# EasyEDA Pro project 25工创PCB.eprj, schematic 显示板原理图
Board Name: 显示板v1; Create Date: 2025-01-09; Page Name: P1; Project Name: 25工创PCB; Schematic Name: 显示板原理图; Update Date: 2025-03-20; Company: 嘉立创EDA; Page Size: A4; Version: V1.0
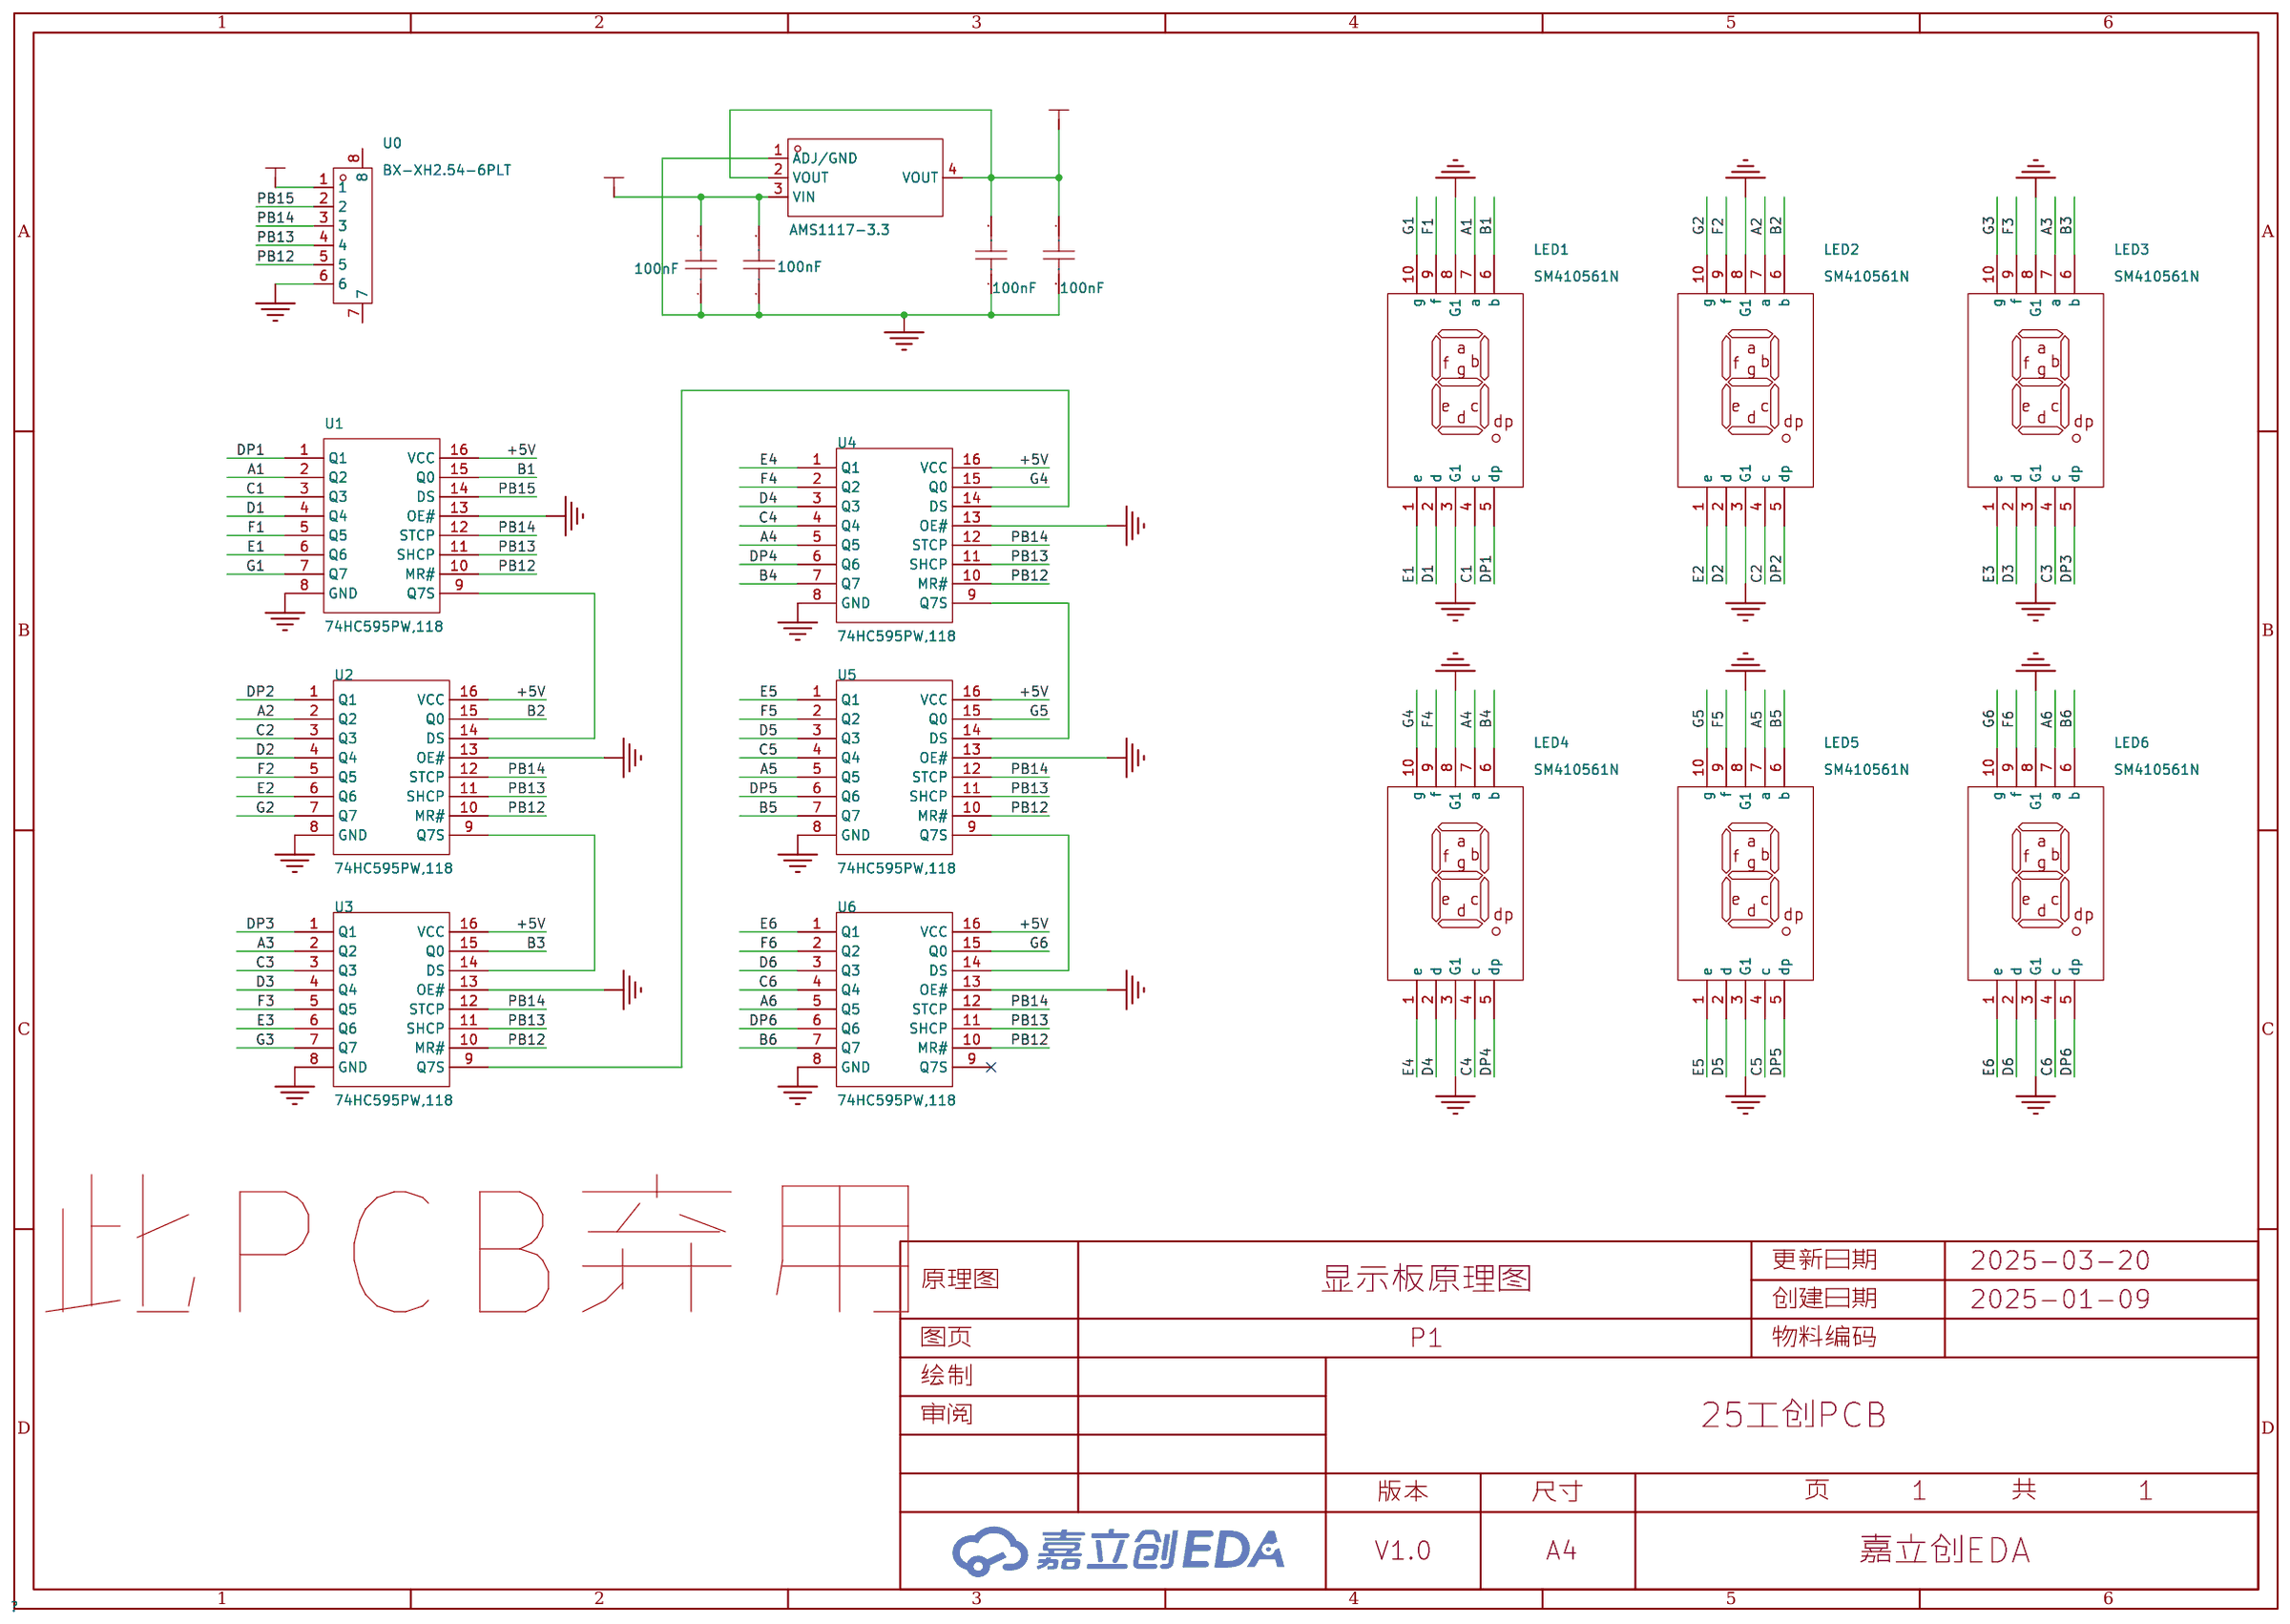
[diagram p3: schematic sheet]

## Parts
C1  100nF  [C0603]
C2  100nF  [C0603]
C3  100nF  [C0603]
C4  100nF  [C0603]
LED1  SM410561N  [LED-SEG-TH_10P-L12.7-W19.0-P2.54-S15.24-BL]
LED2  SM410561N  [LED-SEG-TH_10P-L12.7-W19.0-P2.54-S15.24-BL]
LED3  SM410561N  [LED-SEG-TH_10P-L12.7-W19.0-P2.54-S15.24-BL]
LED4  SM410561N  [LED-SEG-TH_10P-L12.7-W19.0-P2.54-S15.24-BL]
LED5  SM410561N  [LED-SEG-TH_10P-L12.7-W19.0-P2.54-S15.24-BL]
LED6  SM410561N  [LED-SEG-TH_10P-L12.7-W19.0-P2.54-S15.24-BL]
U0  BX-XH2.54-6PLT  [CONN-SMD_6P-P2.50_HANBO_WAFER-254L-6A]
U1  74HC595PW,118  [TSSOP-16_L5.0-W4.4-P0.65-LS6.4-BL]
U2  74HC595PW,118  [TSSOP-16_L5.0-W4.4-P0.65-LS6.4-BL]
U3  74HC595PW,118  [TSSOP-16_L5.0-W4.4-P0.65-LS6.4-BL]
U4  74HC595PW,118  [TSSOP-16_L5.0-W4.4-P0.65-LS6.4-BL]
U5  74HC595PW,118  [TSSOP-16_L5.0-W4.4-P0.65-LS6.4-BL]
U6  74HC595PW,118  [TSSOP-16_L5.0-W4.4-P0.65-LS6.4-BL]
U7  AMS1117-3.3  [SOT-223_L6.5-W3.5-P2.30-LS7.0-BR]

## Library data of the parts
C1-C4 = CAP_0603: Supplier Footprint: 0603
LED1-LED6 = SM410561N: 数码管位数:1位;发光颜色:红色;LED极性:共阳极;数字/字母大小(英寸):0.56;; LCSC Part Name: 1位0.56英寸红色数码管 共阳极; Supplier Part: C141368; Manufacturer: ARKLED(方舟); Supplier Footprint: 插件; JLCPCB Part Class: 扩展库; Datasheet: https://atta.szlcsc.com/upload/public/pdf/source/20171116/C141368_15108221487951123771.pdf; Supplier: LCSC; Number of Characters: 1位; Luminous Color: 红色; LED Polarity: 共阳极; Digit/Alpha Size(inch): 0.56
U0 = BX-XH2.54-6PLT: Supplier Part: C18077885; Manufacturer: Bossie(博锡); Supplier Footprint: SMD,P=2.54mm; JLCPCB Part Class: 扩展库; Datasheet: https://atta.szlcsc.com/upload/public/pdf/source/20231017/9637804775D030D7FDD06F7A89302EEC.pdf; Supplier: LCSC; Pins Structure: 1x6P; Pitch: 2.54mm; Mounting Style: 立贴; Reference Series: XH; Number of Pins: 6P; Number of Rows: 1; Number of PINs Per Row: 6; Current Rating (Max): 3A; Contact Material: 黄铜; Contact Plating: 锡; Operating Temperature Range: -25℃~+85℃
U1-U6 = 74HC595PW,118: 功能:串行至串行或并行;电源电压:2V~6V;元件数:1;每个元件位数:8;; LCSC Part Name: 三态输出 串行至串行或并行移位寄存器; Supplier Part: C5948; Manufacturer: Nexperia(安世); Supplier Footprint: TSSOP-16; JLCPCB Part Class: 扩展库; Datasheet: https://atta.szlcsc.com/upload/public/pdf/source/20180913/C282339_0D5CAAE223E9DCA510F4DD24C6ACF74D.pdf; Supplier: LCSC; Function: 串行至串行或并行; Supply Voltage: 2V~6V; Number of Elements: 1; Number of Bits per Element: 8; Output Type: 三态; Series: 74HC; Operating Temperature: -40℃~+125℃
U7 = AMS1117-3.3_C426566: 输出类型:固定;输出极性:正;输出通道数:1;最大输入电压:18V;输出电压:3.3V;压差:1.4V@(1A);输出电流:1A;电源纹波抑制比(PSRR):70dB@(120Hz);; LCSC Part Name: 正 Vin=18V Vout=3.3V 1A 70dB@(120Hz); Supplier Part: C426566; Manufacturer: Slkor(萨科微); Supplier Footprint: SOT-223; JLCPCB Part Class: Extended Part; Datasheet: https://atta.szlcsc.com/upload/public/pdf/source/20201231/C426566_7F22DB93439D00F3FA27143E4F28C6AA.pdf; Supplier: LCSC; Output Type: 固定; Output Polarity: 正; Number of Outputs: 1; Maximum Input Voltage: 18V; Output Voltage: 3.3V; Dropout Voltage: 1.4V@(1A); Output Current: 1A; Power Supply Rejection Ratio (PSRR): 70dB@(120Hz)

## Nets
+5V: C3.2 C4.1 U1.16(VCC) U2.16(VCC) U3.16(VCC) U4.16(VCC) U5.16(VCC) U6.16(VCC) U7.2(VOUT) U7.4(VOUT)
GND: C1.1 C2.1 C3.1 C4.2 LED1.3(G1) LED1.8(G1) LED2.3(G1) LED2.8(G1) LED3.3(G1) LED3.8(G1) LED4.3(G1) LED4.8(G1) LED5.3(G1) LED5.8(G1) LED6.3(G1) LED6.8(G1) U0.6 U1.8(GND) U1.13(OE#) U2.8(GND) U2.13(OE#) U3.8(GND) U3.13(OE#) U4.8(GND) U4.13(OE#) U5.8(GND) U5.13(OE#) U6.8(GND) U6.13(OE#) U7.1(ADJ/GND)
VCC: C1.2 C2.2 U0.1 U7.3(VIN)
A1: LED1.7(a) U1.2(Q2)
A2: LED2.7(a) U2.2(Q2)
A3: LED3.7(a) U3.2(Q2)
A4: LED4.7(a) U4.5(Q5)
A5: LED5.7(a) U5.5(Q5)
A6: LED6.7(a) U6.5(Q5)
B1: LED1.6(b) U1.15(Q0)
B2: LED2.6(b) U2.15(Q0)
B3: LED3.6(b) U3.15(Q0)
B4: LED4.6(b) U4.7(Q7)
B5: LED5.6(b) U5.7(Q7)
B6: LED6.6(b) U6.7(Q7)
C1: LED1.4(c) U1.3(Q3)
C2: LED2.4(c) U2.3(Q3)
C3: LED3.4(c) U3.3(Q3)
C4: LED4.4(c) U4.4(Q4)
C5: LED5.4(c) U5.4(Q4)
C6: LED6.4(c) U6.4(Q4)
D1: LED1.2(d) U1.4(Q4)
D2: LED2.2(d) U2.4(Q4)
D3: LED3.2(d) U3.4(Q4)
D4: LED4.2(d) U4.3(Q3)
D5: LED5.2(d) U5.3(Q3)
D6: LED6.2(d) U6.3(Q3)
DP1: LED1.5(dp) U1.1(Q1)
DP2: LED2.5(dp) U2.1(Q1)
DP3: LED3.5(dp) U3.1(Q1)
DP4: LED4.5(dp) U4.6(Q6)
DP5: LED5.5(dp) U5.6(Q6)
DP6: LED6.5(dp) U6.6(Q6)
E1: LED1.1(e) U1.6(Q6)
E2: LED2.1(e) U2.6(Q6)
E3: LED3.1(e) U3.6(Q6)
E4: LED4.1(e) U4.1(Q1)
E5: LED5.1(e) U5.1(Q1)
E6: LED6.1(e) U6.1(Q1)
F1: LED1.9(f) U1.5(Q5)
F2: LED2.9(f) U2.5(Q5)
F3: LED3.9(f) U3.5(Q5)
F4: LED4.9(f) U4.2(Q2)
F5: LED5.9(f) U5.2(Q2)
F6: LED6.9(f) U6.2(Q2)
G1: LED1.10(g) U1.7(Q7)
G2: LED2.10(g) U2.7(Q7)
G3: LED3.10(g) U3.7(Q7)
G4: LED4.10(g) U4.15(Q0)
G5: LED5.10(g) U5.15(Q0)
G6: LED6.10(g) U6.15(Q0)
PB12: U0.5 U1.10(MR#) U2.10(MR#) U3.10(MR#) U4.10(MR#) U5.10(MR#) U6.10(MR#)
PB13: U0.4 U1.11(SHCP) U2.11(SHCP) U3.11(SHCP) U4.11(SHCP) U5.11(SHCP) U6.11(SHCP)
PB14: U0.3 U1.12(STCP) U2.12(STCP) U3.12(STCP) U4.12(STCP) U5.12(STCP) U6.12(STCP)
PB15: U0.2 U1.14(DS)
$1N1052: U2.9(Q7S) U3.14(DS)
$1N1079: U3.9(Q7S) U4.14(DS)
$1N1106: U4.9(Q7S) U5.14(DS)
$1N1133: U5.9(Q7S) U6.14(DS)
$1N1798: U1.9(Q7S) U2.14(DS)

Not connected (* = marked no-connect by the designer): U0 7 8; U6 9(Q7S)*

## Notes on the sheet
- 此PCB弃用
